# Altium schematic sheet F1C100S-MY.SchDoc
size A3; PageSetup: Record=PageOptions|CenterHorizontal=True|CenterVertical=True|PrintScale=0.73|XCorrection=1.00|YCorrection=1.00|PrintKind=0|BorderSize=5000000|LeftOffset=0|BottomOffset=0|Orientation=2|PaperLength=1000|PaperWidth=1000|Scale=100|PaperSource=7|PrintQuality=-3|MediaType=1|DitherType=10|PrintScaleMode=1|PaperKind=A4|PaperIndex=9
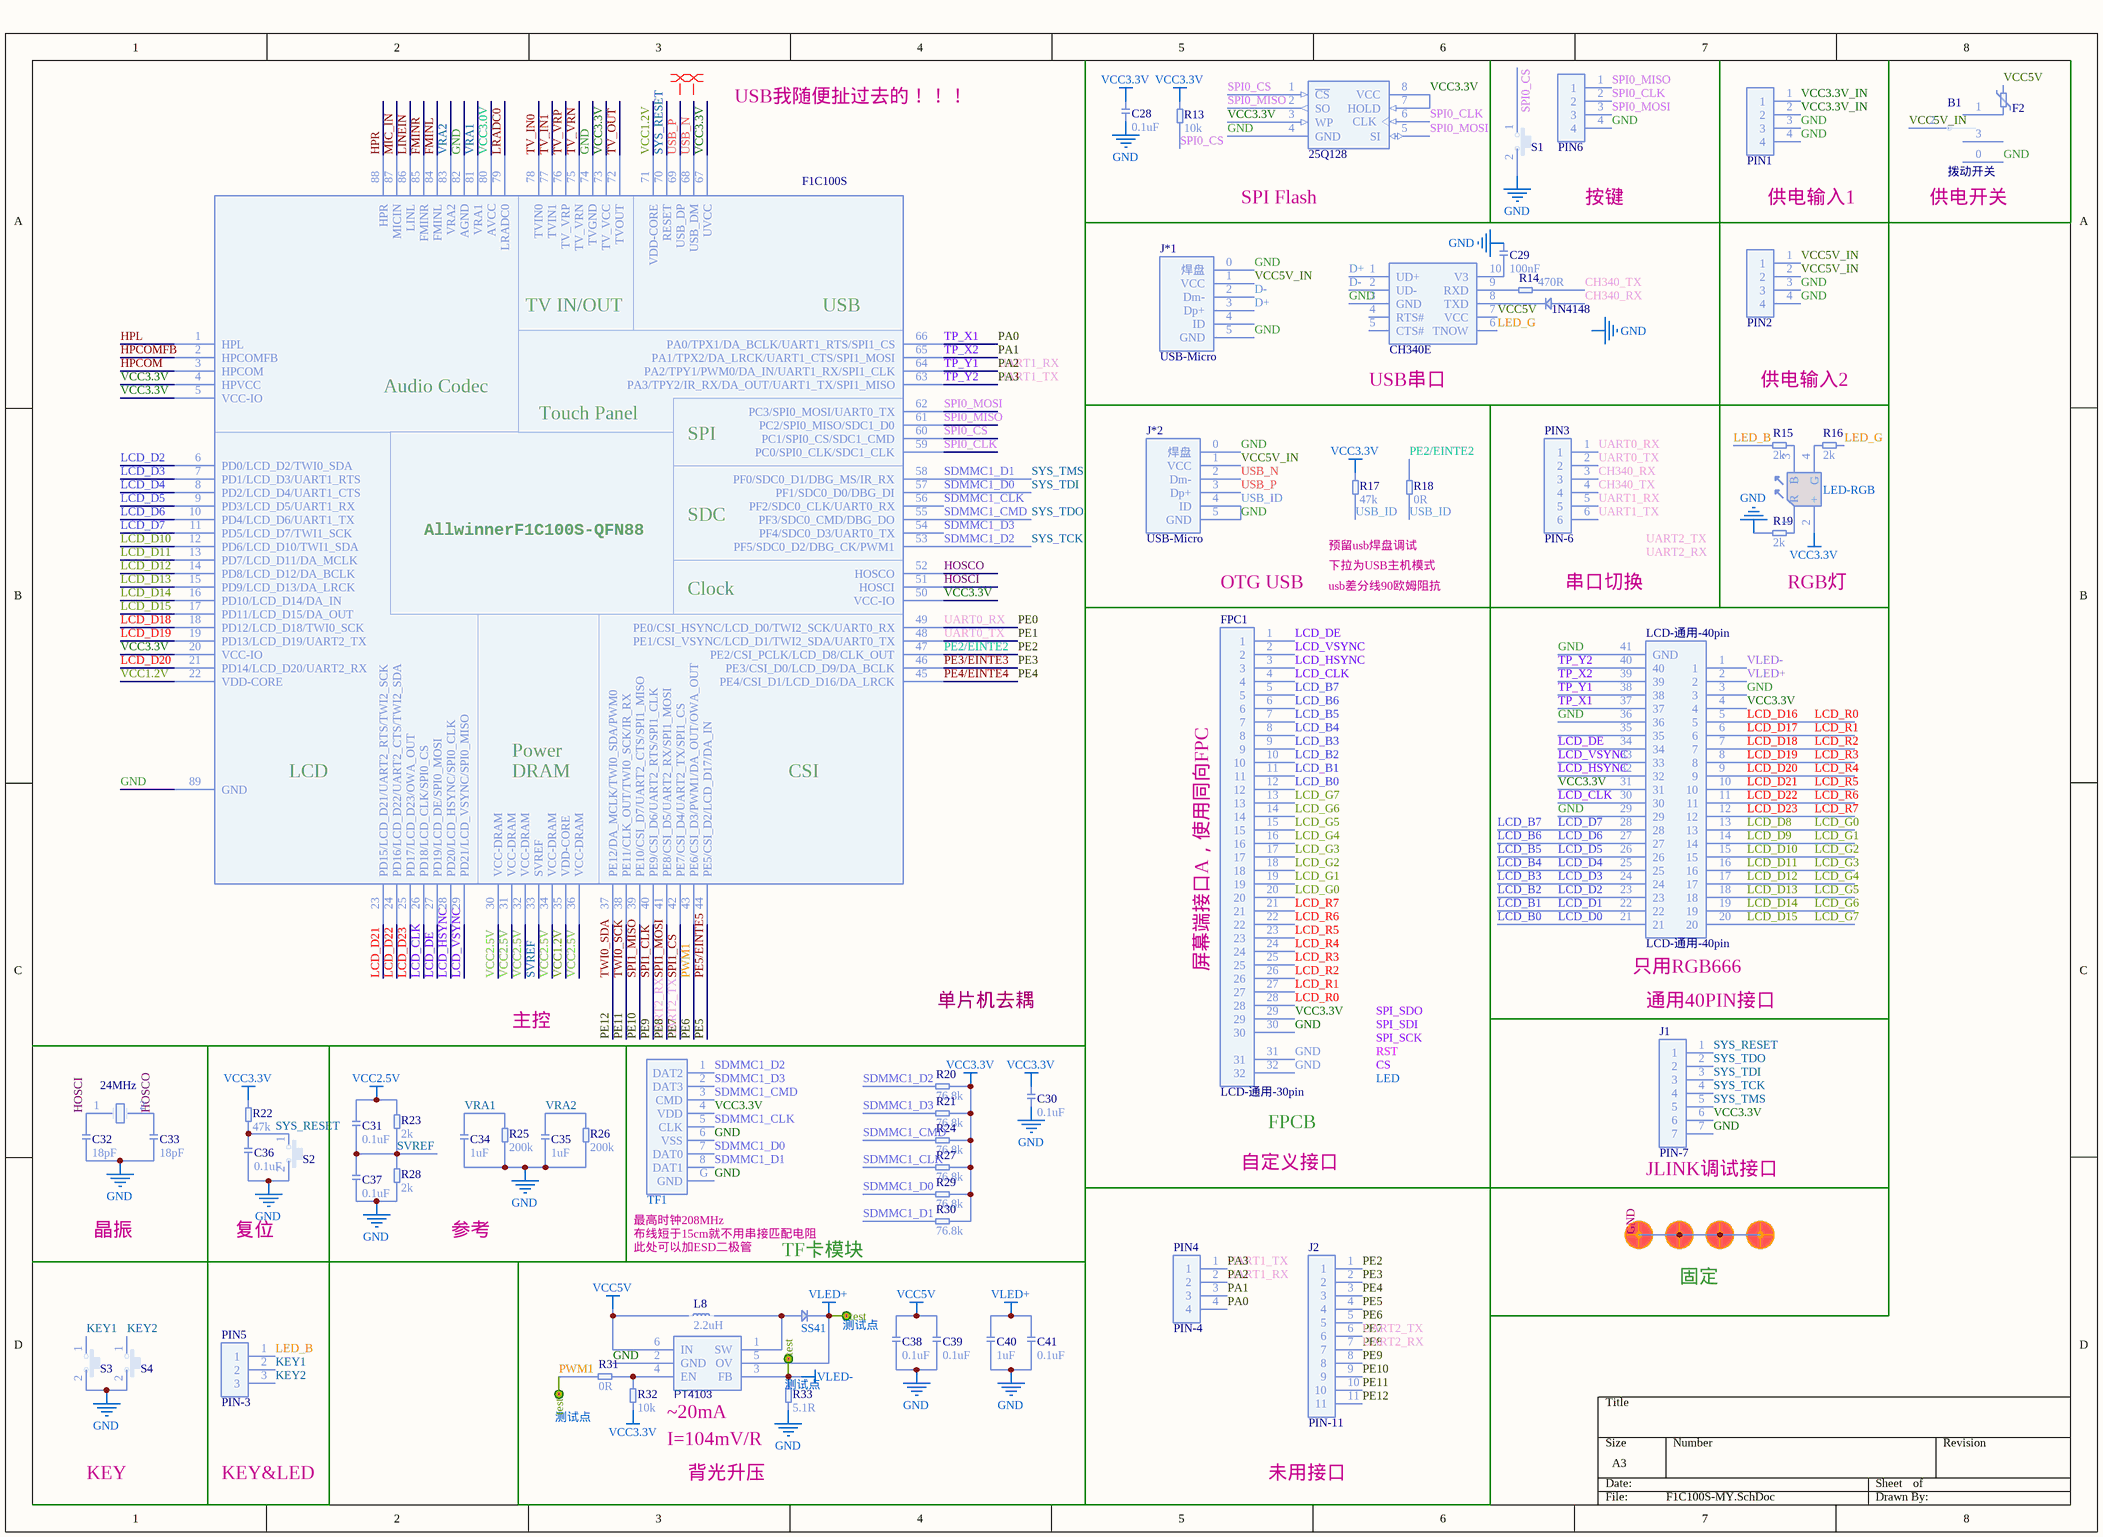
[diagram p0: F1C100S-MY.SchDoc]

## Parts
1N4148  直插1N4148  [L0603]  (value not drawn)
24MHz  XTAL  [AT26-mini]  (value not drawn)
25Q128  25Qxx  [SOP-8M]  (value not drawn)
B1  拨动开关  [拨动开关-侧位-4.4X8.7MM]
C28  value 0.1uF  [0603C-mini]  (hidden comment: 非极性电容)
C29  value 100nF  [0603C-mini]  (hidden comment: 非极性电容)
C30  value 0.1uF  [0603C-mini]  (hidden comment: 非极性电容)
C31  value 0.1uF  [0603C-mini]  (hidden comment: 非极性电容)
C32  value 18pF  [0603C-mini]  (hidden comment: 非极性电容)
C33  value 18pF  [0603C-mini]  (hidden comment: 非极性电容)
C34  value 1uF  [0603C-mini]  (hidden comment: 非极性电容)
C35  value 1uF  [0603C-mini]  (hidden comment: 非极性电容)
C36  value 0.1uF  [0603C-mini]  (hidden comment: 非极性电容)
C37  value 0.1uF  [0603C-mini]  (hidden comment: 非极性电容)
C38  value 0.1uF  [0603C-mini]  (hidden comment: 非极性电容)
C39  value 0.1uF  [0603C-mini]  (hidden comment: 非极性电容)
C40  value 1uF  [0603C-mini]  (hidden comment: 非极性电容)
C41  value 0.1uF  [0603C-mini]  (hidden comment: 非极性电容)
CH340E  USB2UART_CH340E  [MSOP-10]  (value not drawn)
F1C100S  Allwinner-F1C100S  [QFN88]  (value not drawn)
F2  自恢复保险丝  [FU 0603]  (value not drawn)
FPC1  LCD-通用-30pin  [LCD-翻盖式-30PIN-0.5MM-2]
J1  PIN-7  [2.54排针1X7-标准]
J2  PIN-11  [2.54排针1X11-标准]
J3  定位孔  [定位孔 - 1.9MM]  (value not drawn)
J4  定位孔  [定位孔 - 1.9MM]  (value not drawn)
J5  定位孔  [定位孔 - 1.9MM]  (value not drawn)
J6  定位孔  [定位孔 - 1.9MM]  (value not drawn)
J*1  USB-Micro  [USB-MICRO贴片]
J*2  USB-Micro  [USB-MICRO贴片]
L8  value 2.2uH  [SMD-4.5x4.0x3.2mm]  (hidden comment: 贴片电感)
LCD-通用-40pin  LCD-通用-40pin  [LCD-翻盖式-40PIN-0.5MM-2]
LED-RGB  0606 RGB  [0606RGB]  (value not drawn)
PIN1  PIN-4  [2.54排针2X2-标准]  (value not drawn)
PIN2  PIN-4  [2.54排针2X2-标准]  (value not drawn)
PIN3  PIN-6  [2.54排针2X3-标准]
PIN4  PIN-4  [2.54排针1X4-标准]
PIN5  PIN-3  [2.54排针1X3-标准]
PIN6  PIN-4  [2.54排针1X4-标准]  (value not drawn)
PT4103  DCDC_PT4103  [SOT-23-6]  (value not drawn)
R13  value 10k  [R0603-mini]  (hidden comment: 贴片电阻)
R14  value 470R  [R0603-mini]  (hidden comment: 贴片电阻)
R15  value 2k  [R0603-mini]  (hidden comment: 贴片电阻)
R16  value 2k  [R0603-mini]  (hidden comment: 贴片电阻)
R17  value 47k  [R0603-mini]  (hidden comment: 贴片电阻)
R18  value 0R  [R0603-mini]  (hidden comment: 贴片电阻)
R19  value 2k  [R0603-mini]  (hidden comment: 贴片电阻)
R20  value 76.8k  [R0603-non]  (hidden comment: 贴片电阻)
R21  value 76.8k  [R0603-non]  (hidden comment: 贴片电阻)
R22  value 47k  [R0603-mini]  (hidden comment: 贴片电阻)
R23  value 2k  [R0603-mini]  (hidden comment: 贴片电阻)
R24  value 76.8k  [R0603-non]  (hidden comment: 贴片电阻)
R25  value 200k  [R0603-mini]  (hidden comment: 贴片电阻)
R26  value 200k  [R0603-mini]  (hidden comment: 贴片电阻)
R27  value 76.8k  [R0603-non]  (hidden comment: 贴片电阻)
R28  value 2k  [R0603-mini]  (hidden comment: 贴片电阻)
R29  value 76.8k  [R0603-non]  (hidden comment: 贴片电阻)
R30  value 76.8k  [R0603-non]  (hidden comment: 贴片电阻)
R31  value 0R  [R0603-mini]  (hidden comment: 贴片电阻)
R32  value 10k  [R0603-mini]  (hidden comment: 贴片电阻)
R33  value 5.1R  [R0603-mini]  (hidden comment: 贴片电阻)
S1  微动开关2P  [贴片按键微动开关-3*6*2.5]  (value not drawn)
S2  微动开关2P  [贴片按键微动开关-3*6*2.5]  (value not drawn)
S3  微动开关2P  [贴片按键微动开关-3*6*2.5]  (value not drawn)
S4  微动开关2P  [贴片按键微动开关-3*6*2.5]  (value not drawn)
SS41  肖特基二极管  [SMA(DO-214AC)]  (value not drawn)
test7  测试点  [测试点30mil]
test8  测试点  [测试点30mil]
test9  测试点  [测试点30mil]
TF1  TF卡座  [TF卡座C]  (value not drawn)

## Nets
GND: 25Q128.4(GND) B1.0(GND) C28.2 C29.1 C30.2 C32.1 C33.1 C34.2 C35.2 C36.2 C37.2 C38.2 C39.2 C40.2 C41.2 CH340E.3(GND) F1C100S.74(TVGND) F1C100S.82(AGND) F1C100S.89(GND) FPC1.30 FPC1.31 FPC1.32 J1.7 J3.0 J4.0 J5.0 J6.0 J*1.0(焊盘) J*1.5(GND) J*2.0(焊盘) J*2.4(ID) J*2.5(GND) LCD-通用-40pin.3 LCD-通用-40pin.29 LCD-通用-40pin.36 LCD-通用-40pin.41(GND) PIN1.3 PIN1.4 PIN2.3 PIN2.4 PIN6.4 PT4103.2(GND) R17.2 R18.2 R19.2 R25.1 R26.1 R28.1 R33.1 S1.2 S2.2 S3.2 S4.2 TF1.6(VSS) TF1.G(GND)  [also labelled USB_ID]
VCC2.5V: C31.1 F1C100S.30(VCC-DRAM) F1C100S.31(VCC-DRAM) F1C100S.32(VCC-DRAM) F1C100S.34(VCC-DRAM) F1C100S.36(VCC-DRAM) R23.2
VCC3.3V: 25Q128.3(WP) 25Q128.7(HOLD) 25Q128.8(VCC) C28.1 C30.1 F1C100S.4(HPVCC) F1C100S.5(VCC-IO) F1C100S.20(VCC-IO) F1C100S.50(VCC-IO) F1C100S.67(UVCC) F1C100S.73(TV_VCC) FPC1.29 J1.6 LCD-通用-40pin.4 LCD-通用-40pin.31 LED-RGB.2(+) R13.1 R17.1 R20.2 R21.2 R22.1 R24.2 R27.2 R29.2 R30.2 R32.1 TF1.4(VDD)
VCC5V: C38.1 C39.1 CH340E.7(VCC) F2.2 L8.1 PT4103.6(IN)
VLED+: C40.1 C41.1 LCD-通用-40pin.2 PT4103.5(OV) SS41.2 test7.1(test)
VLED-: LCD-通用-40pin.1 PT4103.3(FB) R33.2 test8.1(test)
CH340_RX: 1N4148.1 PIN3.3
CH340_TX: PIN3.4 R14.2
D+: CH340E.1(UD+) J*1.3(Dp+)
D-: CH340E.2(UD-) J*1.2(Dm-)
FMINL: F1C100S.84(FMINL)
FMINR: F1C100S.85(FMINR)
HOSCI: 24MHz.1 C32.2 F1C100S.51(HOSCI)
HOSCO: 24MHz.2 C33.2 F1C100S.52(HOSCO)
HPCOM: F1C100S.3(HPCOM)
HPCOMFB: F1C100S.2(HPCOMFB)
HPL: F1C100S.1(HPL)
HPR: F1C100S.88(HPR)
KEY1: PIN5.2 S3.1
KEY2: PIN5.3 S4.1
LCD_B0: FPC1.12 LCD-通用-40pin.21  [also labelled LCD_D0]
LCD_B1: FPC1.11 LCD-通用-40pin.22  [also labelled LCD_D1]
LCD_B2: F1C100S.6(PD0/LCD_D2/TWI0_SDA) FPC1.10 LCD-通用-40pin.23  [also labelled LCD_D2]
LCD_B3: F1C100S.7(PD1/LCD_D3/UART1_RTS) FPC1.9 LCD-通用-40pin.24  [also labelled LCD_D3]
LCD_B4: F1C100S.8(PD2/LCD_D4/UART1_CTS) FPC1.8 LCD-通用-40pin.25  [also labelled LCD_D4]
LCD_B5: F1C100S.9(PD3/LCD_D5/UART1_RX) FPC1.7 LCD-通用-40pin.26  [also labelled LCD_D5]
LCD_B6: F1C100S.10(PD4/LCD_D6/UART1_TX) FPC1.6 LCD-通用-40pin.27  [also labelled LCD_D6]
LCD_B7: F1C100S.11(PD5/LCD_D7/TWI1_SCK) FPC1.5 LCD-通用-40pin.28  [also labelled LCD_D7]
LCD_CLK: F1C100S.26(PD18/LCD_CLK/SPI0_CS) FPC1.4 LCD-通用-40pin.30
LCD_D8: FPC1.20 LCD-通用-40pin.13  [also labelled LCD_G0]
LCD_D9: FPC1.19 LCD-通用-40pin.14  [also labelled LCD_G1]
LCD_D10: F1C100S.12(PD6/LCD_D10/TWI1_SDA) FPC1.18 LCD-通用-40pin.15  [also labelled LCD_G2]
LCD_D11: F1C100S.13(PD7/LCD_D11/DA_MCLK) FPC1.17 LCD-通用-40pin.16  [also labelled LCD_G3]
LCD_D12: F1C100S.14(PD8/LCD_D12/DA_BCLK) FPC1.16 LCD-通用-40pin.17  [also labelled LCD_G4]
LCD_D13: F1C100S.15(PD9/LCD_D13/DA_LRCK) FPC1.15 LCD-通用-40pin.18  [also labelled LCD_G5]
LCD_D14: F1C100S.16(PD10/LCD_D14/DA_IN) FPC1.14 LCD-通用-40pin.19  [also labelled LCD_G6]
LCD_D15: F1C100S.17(PD11/LCD_D15/DA_OUT) FPC1.13 LCD-通用-40pin.20  [also labelled LCD_G7]
LCD_D16: FPC1.28 LCD-通用-40pin.5  [also labelled LCD_R0]
LCD_D17: FPC1.27 LCD-通用-40pin.6  [also labelled LCD_R1]
LCD_D18: F1C100S.18(PD12/LCD_D18/TWI0_SCK) FPC1.26 LCD-通用-40pin.7  [also labelled LCD_R2]
LCD_D19: F1C100S.19(PD13/LCD_D19/UART2_TX) FPC1.25 LCD-通用-40pin.8  [also labelled LCD_R3]
LCD_D20: F1C100S.21(PD14/LCD_D20/UART2_RX) FPC1.24 LCD-通用-40pin.9  [also labelled LCD_R4]
LCD_D21: F1C100S.23(PD15/LCD_D21/UART2_RTS/TWI2_SCK) FPC1.23 LCD-通用-40pin.10  [also labelled LCD_R5]
LCD_D22: F1C100S.24(PD16/LCD_D22/UART2_CTS/TWI2_SDA) FPC1.22 LCD-通用-40pin.11  [also labelled LCD_R6]
LCD_D23: F1C100S.25(PD17/LCD_D23/OWA_OUT) FPC1.21 LCD-通用-40pin.12  [also labelled LCD_R7]
LCD_DE: F1C100S.27(PD19/LCD_DE/SPI0_MOSI) FPC1.1 LCD-通用-40pin.34
LCD_HSYNC: F1C100S.28(PD20/LCD_HSYNC/SPI0_CLK) FPC1.3 LCD-通用-40pin.32
LCD_VSYNC: F1C100S.29(PD21/LCD_VSYNC/SPI0_MISO) FPC1.2 LCD-通用-40pin.33
LED_B: PIN5.1 R15.2
LED_G: CH340E.6(TNOW) R16.2
LINEIN: F1C100S.86(LINL)
LRADC0: F1C100S.79(LRADC0)
MIC_IN: F1C100S.87(MICIN)
PA0: F1C100S.66(PA0/TPX1/DA_BCLK/UART1_RTS/SPI1_CS) LCD-通用-40pin.37 PIN4.4  [also labelled TP_X1]
PA1: F1C100S.65(PA1/TPX2/DA_LRCK/UART1_CTS/SPI1_MOSI) LCD-通用-40pin.39 PIN4.3  [also labelled TP_X2]
PA2: F1C100S.64(PA2/TPY1/PWM0/DA_IN/UART1_RX/SPI1_CLK) LCD-通用-40pin.38 PIN3.5 PIN4.2  [also labelled TP_Y1, UART1_RX]
PA3: F1C100S.63(PA3/TPY2/IR_RX/DA_OUT/UART1_TX/SPI1_MISO) LCD-通用-40pin.40 PIN3.6 PIN4.1  [also labelled TP_Y2, UART1_TX]
PE0: F1C100S.49(PE0/CSI_HSYNC/LCD_D0/TWI2_SCK/UART0_RX) PIN3.1  [also labelled UART0_RX]
PE1: F1C100S.48(PE1/CSI_VSYNC/LCD_D1/TWI2_SDA/UART0_TX) PIN3.2  [also labelled UART0_TX]
PE2: F1C100S.47(PE2/CSI_PCLK/LCD_D8/CLK_OUT) J2.1 R18.1  [also labelled PE2/EINTE2]
PE3: F1C100S.46(PE3/CSI_D0/LCD_D9/DA_BCLK) J2.2  [also labelled PE3/EINTE3]
PE4: F1C100S.45(PE4/CSI_D1/LCD_D16/DA_LRCK) J2.3  [also labelled PE4/EINTE4]
PE5: F1C100S.44(PE5/CSI_D2/LCD_D17/DA_IN) J2.4  [also labelled PE5/EINTE5]
PE6: F1C100S.43(PE6/CSI_D3/PWM1/DA_OUT/OWA_OUT) J2.5 R31.2 test9.1(test)  [also labelled PWM1]
PE7: F1C100S.42(PE7/CSI_D4/UART2_TX/SPI1_CS) J2.6  [also labelled SPI1_CS, UART2_TX]
PE8: F1C100S.41(PE8/CSI_D5/UART2_RX/SPI1_MOSI) J2.7  [also labelled SPI1_MOSI, UART2_RX]
PE9: F1C100S.40(PE9/CSI_D6/UART2_RTS/SPI1_CLK) J2.8  [also labelled SPI1_CLK]
PE10: F1C100S.39(PE10/CSI_D7/UART2_CTS/SPI1_MISO) J2.9  [also labelled SPI1_MISO]
PE11: F1C100S.38(PE11/CLK_OUT/TWI0_SCK/IR_RX) J2.10  [also labelled TWI0_SCK]
PE12: F1C100S.37(PE12/DA_MCLK/TWI0_SDA/PWM0) J2.11  [also labelled TWI0_SDA]
SDMMC1_CLK: F1C100S.56(PF2/SDC0_CLK/UART0_RX) R27.1 TF1.5(CLK)
SDMMC1_CMD: F1C100S.55(PF3/SDC0_CMD/DBG_DO) J1.2 R24.1 TF1.3(CMD)  [also labelled SYS_TDO]
SDMMC1_D0: F1C100S.57(PF1/SDC0_D0/DBG_DI) J1.3 R29.1 TF1.7(DAT0)  [also labelled SYS_TDI]
SDMMC1_D1: F1C100S.58(PF0/SDC0_D1/DBG_MS/IR_RX) J1.5 R30.1 TF1.8(DAT1)  [also labelled SYS_TMS]
SDMMC1_D2: F1C100S.53(PF5/SDC0_D2/DBG_CK/PWM1) J1.4 R20.1 TF1.1(DAT2)  [also labelled SYS_TCK]
SDMMC1_D3: F1C100S.54(PF4/SDC0_D3/UART0_TX) R21.1 TF1.2(DAT3)
SPI0_CLK: 25Q128.6(CLK) F1C100S.59(PC0/SPI0_CLK/SDC1_CLK) PIN6.2
SPI0_CS: 25Q128.1(~{CS}) F1C100S.60(PC1/SPI0_CS/SDC1_CMD) R13.2 S1.1
SPI0_MISO: 25Q128.2(SO) F1C100S.61(PC2/SPI0_MISO/SDC1_D0) PIN6.1
SPI0_MOSI: 25Q128.5(SI) F1C100S.62(PC3/SPI0_MOSI/UART0_TX) PIN6.3
SVREF: C31.2 C37.1 F1C100S.33(SVREF) R23.1 R28.2
SYS_RESET: C36.1 F1C100S.70(RESET) J1.1 R22.2 S2.1
TV_IN0: F1C100S.78(TVIN0)
TV_IN1: F1C100S.77(TVIN1)
TV_OUT: F1C100S.72(TVOUT)
TV_VRN: F1C100S.75(TV_VRN)
TV_VRP: F1C100S.76(TV_VRP)
USB_N: F1C100S.68(USB_DM) J*2.2(Dm-)
USB_P: F1C100S.69(USB_DP) J*2.3(Dp+)
VCC1.2V: F1C100S.22(VDD-CORE) F1C100S.35(VDD-CORE) F1C100S.71(VDD-CORE)
VCC3.0V: F1C100S.80(AVCC)
VCC3.3V_IN: PIN1.1 PIN1.2
VCC5V_IN: B1.2 J*1.1(VCC) J*2.1(VCC) PIN2.1 PIN2.2
VRA1: C34.1 F1C100S.81(VRA1) R25.2
VRA2: C35.1 F1C100S.83(VRA2) R26.2
Net1N4148_2: 1N4148.2 CH340E.8(TXD)
NetB1_1: B1.1 F2.1
NetC29_2: C29.2 CH340E.10(V3)
NetCH340E_9: CH340E.9(RXD) R14.1
NetL8_2: L8.2 PT4103.1(SW) SS41.1
NetLED-RGB_1: LED-RGB.1(R) R19.1
NetLED-RGB_3: LED-RGB.3(B) R15.1
NetLED-RGB_4: LED-RGB.4(G) R16.1
NetPT4103_4: PT4103.4(EN) R31.1 R32.2

Not connected (* = marked no-connect by the designer): B1 3; CH340E 4(RTS#) 5(CTS#); J*1 4(ID); LCD-通用-40pin 35

## Layout directives
differential pair: (no net found under the mark)

## Notes on the sheet
- USB我随便扯过去的！！！
- SPI Flash
- 按键
- 供电输入1
- (near B1) 供电开关
- (near CH340E) USB串口
- 供电输入2
- OTG USB
- usb差分线90欧姆阻抗
- 下拉为USB主机模式
- 预留usb焊盘调试
- 串口切换
- (near R19) RGB灯
- 单片机去耦
- (near J1) 通用40PIN接口
- 主控
- 自定义接口
- (near J1) JLINK调试接口
- 晶振
- 复位
- 参考
- KEY
- KEY&LED
- 未用接口
- Labels drawn without touching a wire or pin: CS, FPCB, GND, I=104mV/R, LED, RST, SPI_SCK, SPI_SDI, SPI_SDO, TF卡模块, UART2_RX, UART2_TX, ~20mA, 只用RGB666, 固定, 屏幕端接口A，使用同向FPC, 布线短于15cm就不用串接匹配电阻, 最高时钟208MHz, 此处可以加ESD二极管, 背光升压
- (in symbol Allwinner-F1C100S) TV IN/OUT; USB; Audio Codec; Touch Panel; SPI; SDC; AllwinnerF1C100S-QFN88; Clock; Power; LCD; DRAM; CSI

## Library data of the parts
25Q128 = 25Qxx: 外置EEPROM; BOM名称: 外置EEPROM
CH340E = USB2UART_CH340E: USB2UART
PT4103 = DCDC_PT4103: 升压型DCDC; input: -0.3～6V; spiceSymbolName: PT4103
TF1 = TF卡座2